# EAGLE design Sensor_Adapter_1.0.0 (EAGLE 9.6.2)
VVERSION: v2.4.5 Mar 2023
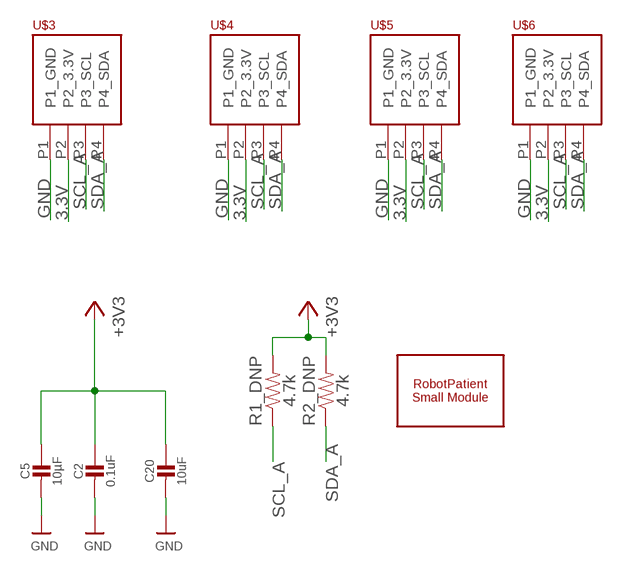
[diagram p0: schematic, sheet 1]

## Parts
C2  0.1uF  CAP_CERAMIC0603  [0603]
C5  10µF  CAP_CERAMIC0805  [0805]
C20  10uF  CAP_CERAMIC0805  [0805]
R1_DNP  4.7k  4.7KOHM-0603-1/10W-1%  [0603]
R2_DNP  4.7k  4.7KOHM-0603-1/10W-1%  [0603]
U$1  ROBOTPATIENT_SMALL_MODULEBOARD  [RP_SMALL_SENSOR_OUTLINE]
U$3  PHOENIX_PTSM_M4_THANGLE  [PTSM_M4_TH]
U$4  PHOENIX_PTSM_M4_THANGLE  [PTSM_M4_TH]
U$5  PHOENIX_PTSM_M4_THANGLE  [PTSM_M4_TH]
U$6  PHOENIX_PTSM_M4_THANGLE  [PTSM_M4_TH]

## Nets
3.3V [power]: C2.1 C5.1 C20.1 R1_DNP.2 R2_DNP.2 U$3.P2(P2_3.3V) U$4.P2(P2_3.3V) U$5.P2(P2_3.3V) U$6.P2(P2_3.3V) ; supply symbol labelled +3V3
GND [ground]: C2.2 C5.2 C20.2 U$3.P1(P1_GND) U$4.P1(P1_GND) U$5.P1(P1_GND) U$6.P1(P1_GND)
SCL_A: R1_DNP.1 U$3.P3(P3_SCL) U$4.P3(P3_SCL) U$5.P3(P3_SCL) U$6.P3(P3_SCL)
SDA_A: R2_DNP.1 U$3.P4(P4_SDA) U$4.P4(P4_SDA) U$5.P4(P4_SDA) U$6.P4(P4_SDA)

## Library data of the parts
C2 C5 C20 = microbuilder:CAP_CERAMIC: Ceramic Capacitors 0402 - 0402 Surface Mount Capacitors 16pF 50V 5% [Digikey: 445-4899-2-ND] 18pF 50V 5% [Digikey: 490-1281-2-ND] 22pF 50V 5% [Digikey: 490-1283-2-ND] 68pF 50V 5% [Digikey: 490-1289-2-ND] 0.1uF 10V 10% [Digikey: 490-1318-2-ND] 1.0uF 6.3V 10% [Digikey: 490-1320-2-ND] 0603 - 0603 Surface Mount Capacitors 16 pF 50V 5% [Digikey: 445-5051-2-ND] 22 pF 50V [Digikey: PCC220ACVTR-ND] 33 pF 50V 5% [Digikey: 490-1415-1-ND] 56pF 50V 5% [Digikey: 490-1421-1-ND] 220pF 50V 5% [Digikey: 445-1285-1-ND] 680 pF 50V 2200 pF 50V 5% C0G [Digikey: 445-1297-1-ND] 5600 pF 100V 5% X7R [Digikey: 478-3711-1-ND] 0.1 µF 25V 10% [Digikey: PCC2277TR-ND] 0.22 µF 16V 10% X7R [Digikey: 445-1318-1-ND] 1.0 µF 25V 10% [Digikey: 445-5146-2-ND] 0603 - RF Specific 3pF 250V +/-0.1pF RF [Digikey: 712-1347-1-ND] 18 pF 250V 5% [Digikey: 478-3505-1-ND or 712-1322-1-ND] 56 pF 250V 5% C0G RF [Digikey: 490-4867-1-ND] 68 pF 250V RF [Digikey: 490-4868-1-ND] 0805 - 0805 Surface Mount Capacitors 220 pF 250V 2% RF Ceramic Capacitor [Digikey: 712-1398-1-ND] 1000 pF 50V 2% NP0 Ceramic Capacitor [Digikey: 478-3760-1-ND] 0.1 µF 25V 10% Ceramic Capacitor [Digikey: PCC1828TR-ND] 1.0 µF 16V 10% Ceramic Capacitor[Digikey: 490-1691-2-ND] 10.0 µF 10V 10% Ceramic Capacitor[Digikey: 709-1228-1-ND] 10.0 uF 16V 10% Ceramic Capacitor [Digikey: 478-5165-2-ND] 47 uF 6.3V 20% Ceramic Capacitor [Digikey: 587-1779-1-ND or 399-5506-1-ND] 1206 - 1206 Surface Mount Capacitors 47uF 10V 20% Ceramic Capacitor [Digikey: 490-5528-1-ND or 399-5508-1-ND or 445-6010-1-ND] 100uF 6.3V -20%, +80% Y5V Ceramic Capacitor (Digikey: 490-4512-1-ND, Mouser: 81-GRM31CF50J107ZE1L)
R1_DNP R2_DNP = SparkFun-Resistors:4.7KOHM: 4.7kΩ resistor A resistor is a passive two-terminal electrical component that implements electrical resistance as a circuit element. Resistors act to reduce current flow, and, at the same time, act to lower voltage levels within circuits. - Wikipedia; PROD_ID: RES-07857
U$1 = jk_customs:ROBOTPATIENT_SMALL_MODULE
U$3-U$6 = jk_customs:PHOENIX_PTSM_M4_TH

## Net classes
1 power: width 0.305 mm
2 ground: width 0.254 mm, drill 0.254 mm, clearance 0.152 mm

## Board
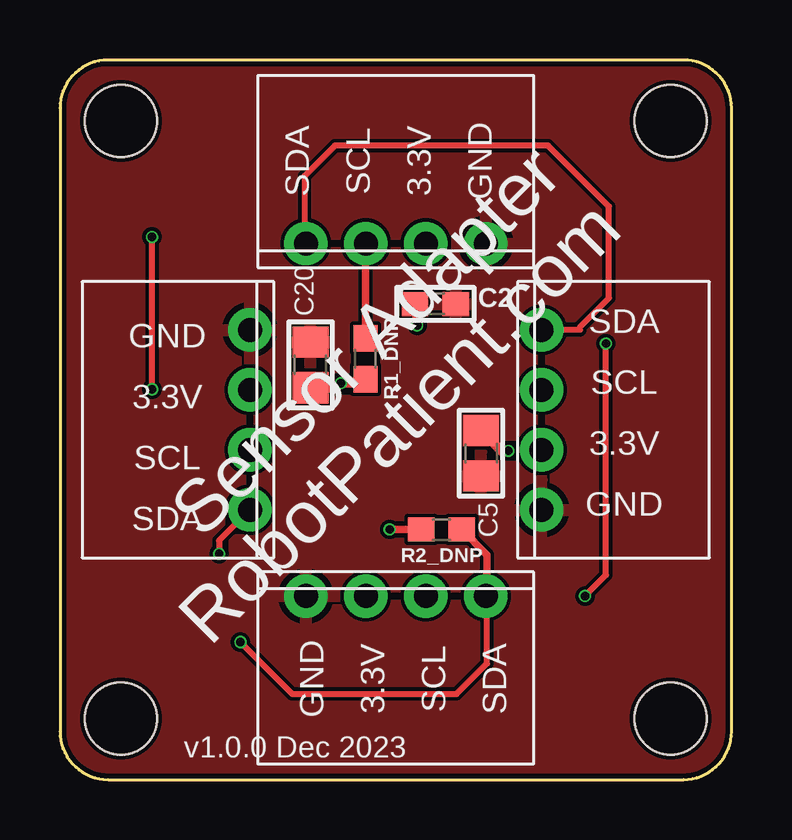
[diagram p1: board, top side]
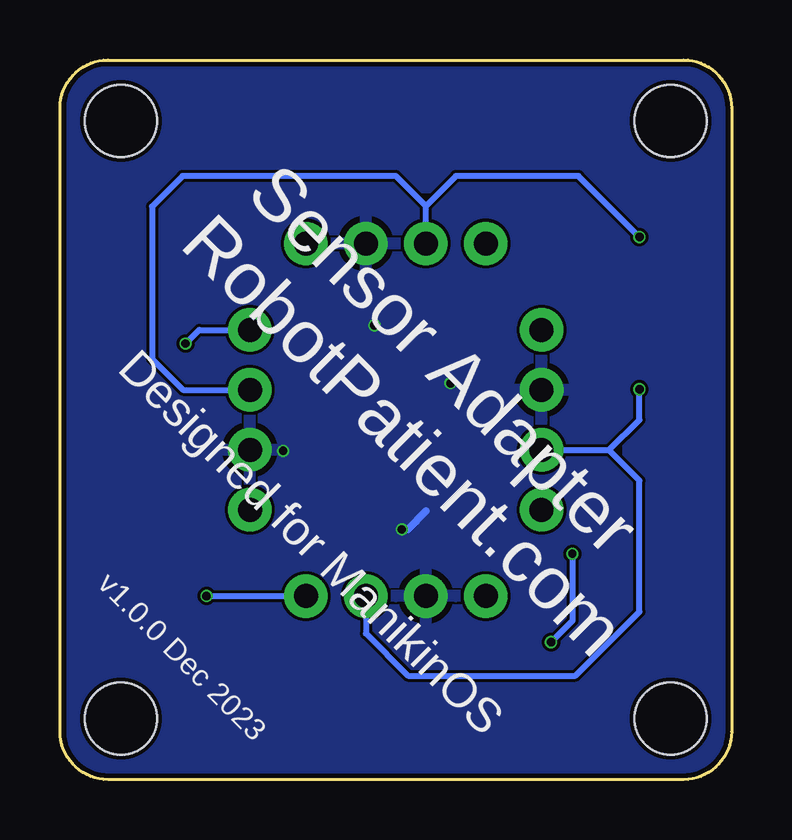
[diagram p2: board, bottom side, seen from below]

Size 28 x 30 mm. Coordinates in mm from the lower left corner, seen from the top.
Copper layers (1*16): Top 0.035mm / dielectric 1.6mm / Bottom 0.035mm
Design rules "jlcpcb-2layers_2023": minimum track width 5mil, minimum drill 0.3mm, track to track 5mil, track to pad 5mil, pad to pad 5mil, via to via 5mil, smd to smd 5mil, copper to edge 0.2mm, drill to drill 6mil, minimum pad ring 10mil, minimum via ring 3mil, stop-mask expansion 4mil, vias tented up to drill 20mil, thermal gap 10mil

### Footprints (pad centres in the part's own frame; a part is rotated, then mirrored left to right if it is on the bottom)
0603 = smd 1.1 x 1: 1 -0.85,0; 2 0.85,0
0805 = smd 1.3 x 1.5: 1 -0.95,0; 2 0.95,0
RP_SMALL_SENSOR_OUTLINE = hole 3: -11.455,12.455; 11.455,12.455; 11.455,-12.455; -11.455,-12.455
PTSM_M4_TH = drill 1: P1 3.75,1; P2 1.25,1; P3 -1.25,1; P4 -3.75,1

### Placement (x,y rotation side)
C2  15.65,19.83 0 top
C5  17.56,13.6 270 top
C20  10.44,17.29 90 top
R1_DNP  12.73,17.54 270 top
R2_DNP  15.9,10.43 180 top
U$1  14,15 0 top
U$3  14,21.35 0 top
U$4  8.92,15 90 top
U$5  19.08,15 270 top
U$6  14,8.65 180 top

### Tracks (layer width: path | path; a pad name or v marks a point on that pad's centre or on a via)
3.3V  (via drill 0.35)
  Top 0.305: 15.02,10.47 R2_DNP.2 v13.75,10.43 | R1_DNP.2 12.38,16.34
  Top 0.406: C5.1 18.4,13.71 v18.7,13.71 | R1_DNP.2 12.56,16.52 v11.71,16.52 11.53,16.34 C20.1 | C2.1 14.89,19.74 v14.89,18.94
  Bottom 0.305: v13.75,10.43 13.49,10.43 12.73,11.19
  pour Bottom: -40.54,33.25 -40.54,-46 70,-46 70,33.25
GND
  pour Top: -38,38.06 -38,-46 70.5,-46 70.5,38.06
SCL_A  (via drill 0.35)
  Top 0.254: v3.84,16.27 v3.84,22.62
  Top 0.305: R1_DNP.1 12.73,22.33 U$3.P3
  Bottom 0.254: U$3.P3 12.75,23.91 | 12.75,23.91 14,25.16 22.89,25.16 24.16,23.89 24.16,17.54 22.87,16.25 U$5.P3 | U$6.P3 15.25,6.09 13.49,4.33 6.51,4.33 3.84,7 3.84,12.46 5.11,13.73 | U$4.P3 7.9,13.73 5.11,13.73 | 5.11,13.73 3.84,15 v3.84,16.27 | v3.84,22.62 6.38,25.16 11.5,25.16 12.75,23.91
SDA_A  (via drill 0.35)
  Top 0.254: v21.89,7.65 22.76,8.52 v22.76,18.18 | U$5.P4 21.68,18.75 21.68,18.87 22.89,20.08 22.89,23.89 20.35,26.43 11.46,26.43 10.19,25.16 10.19,22.41 U$3.P4 | U$6.P4 17.81,7.59 17.81,4.84 16.54,3.57 9.68,3.57 v7.52,5.73 | U$4.P4 6.63,9.96 v6.63,9.41
  Top 0.305: R2_DNP.1 17.81,9.37 17.81,7.59
  Bottom 0.254: v6.63,9.41 6.63,6.62 v7.52,5.73 | v21.89,7.65 U$6.P4 | v22.76,18.18 22.19,18.75 U$5.P4

### Text on the board
_tsilk: RobotPatient.com
_bsilk: RobotPatient.com | Designed for ManikinOS